# EAGLE schematic Redesign-8Ch-Mux-Breakout-PMODIA (EAGLE 9.6.2)
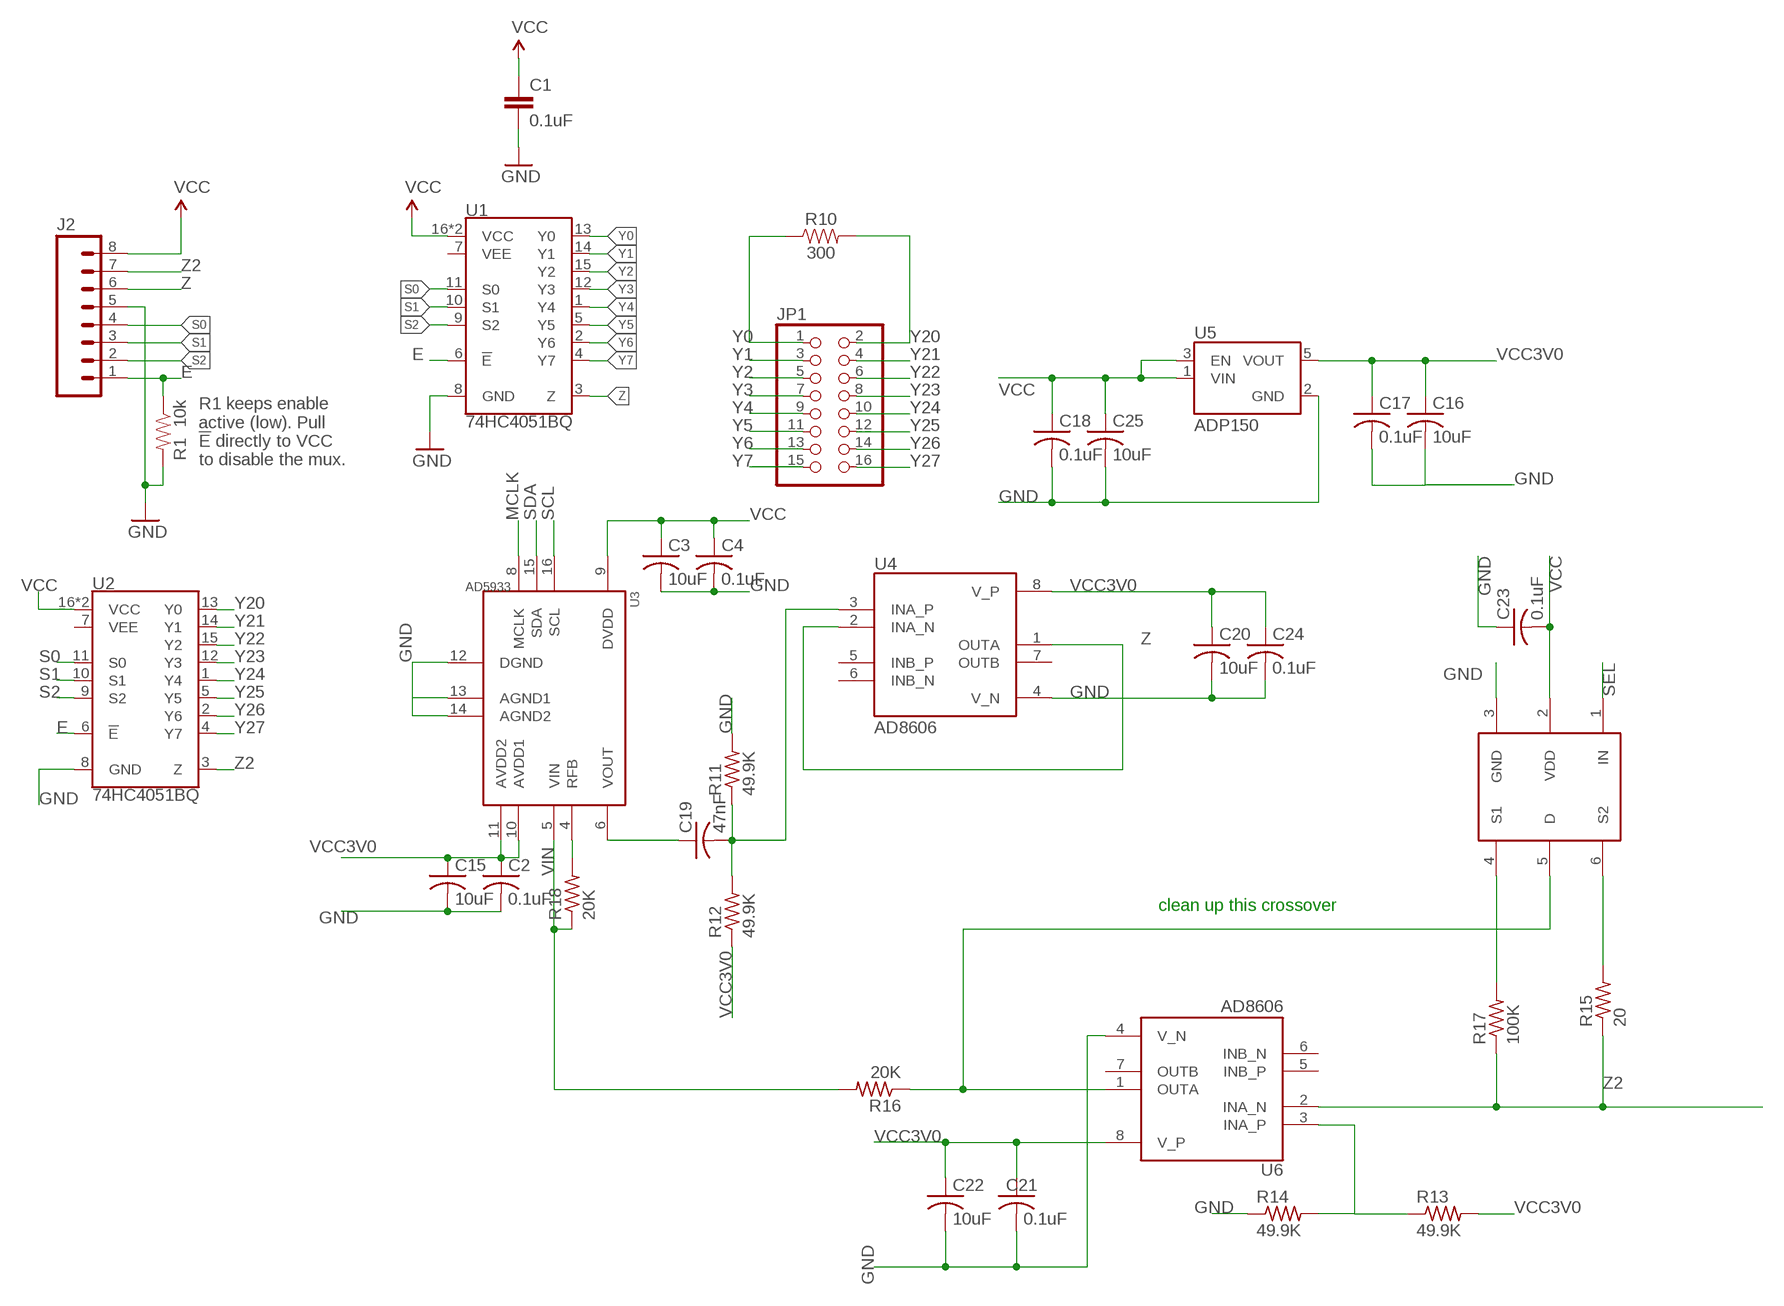
[diagram p0: schematic, sheet 1]

## Parts
C1  0.1uF  0.1UF-0603-25V-(+80/-20%)  [0603]
C2  0.1uF  C-USC0805K  [C0805K]
C3  10uF  C-USC0805K  [C0805K]
C4  0.1uF  C-USC0805K  [C0805K]
C15  10uF  C-USC0805K  [C0805K]
C16  10uF  C-USC0805K  [C0805K]
C17  0.1uF  C-USC0805K  [C0805K]
C18  0.1uF  C-USC0805K  [C0805K]
C19  47nF  C-USC0805K  [C0805K]
C20  10uF  C-USC0805K  [C0805K]
C21  0.1uF  C-USC0805K  [C0805K]
C22  10uF  C-USC0805K  [C0805K]
C23  0.1uF  C-USC0805K  [C0805K]
C24  0.1uF  C-USC0805K  [C0805K]
C25  10uF  C-USC0805K  [C0805K]
J2  M08  [1X08_ROUND]
JP1  PINHD-2X8  [2X08]
R1  10k  10KOHM-0603-1/10W-1%  [0603]
R10  300  0.3OHM-0805-1/8W-1%  [0805]
R11  49.9K  R-US_R0603  [R0603]
R12  49.9K  R-US_R0603  [R0603]
R13  49.9K  R-US_R0603  [R0603]
R14  49.9K  R-US_R0603  [R0603]
R15  20  R-US_R0603  [R0603]
R16  20K  R-US_R0603  [R0603]
R17  100K  R-US_R0603  [R0603]
R18  20K  R-US_R0603  [R0603]
U1  74HC4051BQ  [DHVQFN-16-2.5X3.5MM]
U2  74HC4051BQ  [DHVQFN-16-2.5X3.5MM]
U3  AD5933  [SSOP16]
U4  AD8606  [SOIC-8]
U5  ADP150  [SOT95P280X100-5N]
U6  AD8606  [SOIC-8]
U$1  ADG849THROUHG_HOLE  [SOT65P210X110-6N]

## Nets
E: J2.1 R1.1 U1.6(!E!) U2.6(!E!)
GND: C1.2 C2.2 C3.2 C4.2 C15.2 C16.2 C17.2 C18.2 C20.2 C21.2 C22.2 C23.1 C24.2 C25.2 J2.5 R1.2 R11.2 R14.1 U1.8(GND) U2.8(GND) U3.12(DGND) U3.14(AGND2) U4.4(V_N) U5.2(GND) U6.4(V_N) U$1.3(GND)
MCLK: U3.8(MCLK)
N$1: C19.1 U3.6(VOUT)
N$3: C19.2 R11.1 R12.2 U4.3(INA_P)
N$4: R13.1 R14.2 U6.3(INA_P)
N$5: R18.2 U3.4(RFB)
N$6: R15.2 U$1.6(S2)
N$8: U3.13(AGND1)
N$9: R17.2 U$1.4(S1)
N$11: R16.1 U6.1(OUTA) U$1.5(D)
S0: J2.4 U1.11(S0) U2.11(S0)
S1: J2.3 U1.10(S1) U2.10(S1)
S2: J2.2 U1.9(S2) U2.9(S2)
SCL: U3.16(SCL)
SDA: U3.15(SDA)
SEL: U$1.1(IN)
VCC: C1.1 C3.1 C4.1 C18.1 C23.2 C25.1 J2.8 U1.16(VCC) U1.EP(VCC) U2.16(VCC) U2.EP(VCC) U3.9(DVDD) U5.1(VIN) U5.3(EN) U$1.2(VDD)
VCC3V0: C2.1 C15.1 C16.1 C17.1 C20.1 C21.1 C22.1 C24.1 R12.1 R13.2 U3.10(AVDD1) U3.11(AVDD2) U4.8(V_P) U5.5(VOUT) U6.8(V_P)
VIN: R16.2 R18.1 U3.5(VIN)
Y0: JP1.1 R10.1 U1.13(Y0)
Y1: JP1.3 U1.14(Y1)
Y2: JP1.5 U1.15(Y2)
Y3: JP1.7 U1.12(Y3)
Y4: JP1.9 U1.1(Y4)
Y5: JP1.11 U1.5(Y5)
Y6: JP1.13 U1.2(Y6)
Y7: JP1.15 U1.4(Y7)
Y20: JP1.2 R10.2 U2.13(Y0)
Y21: JP1.4 U2.14(Y1)
Y22: JP1.6 U2.15(Y2)
Y23: JP1.8 U2.12(Y3)
Y24: JP1.10 U2.1(Y4)
Y25: JP1.12 U2.5(Y5)
Y26: JP1.14 U2.2(Y6)
Y27: JP1.16 U2.4(Y7)
Z: J2.6 U1.3(Z) U4.1(OUTA) U4.2(INA_N)
Z2: J2.7 R15.1 R17.1 U2.3(Z) U6.2(INA_N)
Unconnected: U1.7(VEE) U2.7(VEE) U4.5(INB_P) U4.6(INB_N) U4.7(OUTB) U6.5(INB_P) U6.6(INB_N) U6.7(OUTB)

## Notes on the sheet
- R1 keeps enable 
  active (low). Pull 
  !E! directly to VCC 
  to disable the mux.
- clean up this crossover

## Library data of the parts
C1 = SparkFun-Capacitors:0.1UF: 0.1µF ceramic capacitors A capacitor is a passive two-terminal electrical component used to store electrical energy temporarily in an electric field.; PROD_ID: CAP-00810
C2-C4 C15-C25 = rcl:C-US: CAPACITOR, American symbol; SPICEPREFIX: C
J2 = SparkFun-Connectors:M08: Header 8 Standard 8-pin 0.1" header. Use with straight break away headers (SKU : PRT-00116), right angle break away headers (PRT-00553), swiss pins (PRT-00743), machine pins (PRT-00117), and female headers (PRT-00115).; PROD_ID: CONN-08437
JP1 = pinhead:PINHD-2X8: PIN HEADER
R1 = SparkFun-Resistors:10KOHM: 10kΩ resistor A resistor is a passive two-terminal electrical component that implements electrical resistance as a circuit element. Resistors act to reduce current flow, and, at the same time, act to lower voltage levels within circuits. - Wikipedia; PROD_ID: RES-00824
R10 = SparkFun-Resistors:0.3OHM: 0.3Ω resistor A resistor is a passive two-terminal electrical component that implements electrical resistance as a circuit element. Resistors act to reduce current flow, and, at the same time, act to lower voltage levels within circuits. - Wikipedia; PROD_ID: RES-11622; VALUE: 0.3
R11-R18 = rcl:R-US_: RESISTOR, American symbol; SPICEPREFIX: R
U1 U2 = 8mux:74HC4051: NXP 74HC4051 8-Channel Analog Multiplexer/Demultiplexer The 74HC4051; 74HCT4051 is a single-pole octal-throw analog switch (SP8T) suitable for use in analog or digital 8:1 multiplexer/demultiplexer applications. The switch features three digital select inputs (S0, S1 and S2), eight independent inputs/outputs (Yn), a common input/output (Z) and a digital enable input (E). When E is HIGH, the switches are turned off. Inputs include clamp diodes. This enables the use of current limiting resistors to interface inputs to voltages in excess of VCC. Datasheet <http://www.nxp.com/documents/data_sheet/74HC_HCT4051.pdf>; PROD_ID: IC-13334
U3 = PMODIA:AD5933: 1 MSPS, 12-Bit Impedance Converter, Network Analyzer Applications: Electrochemical analysis Bioelectrical impedance analysis Impedance spectroscopy Complex impedance measurement Corrosion monitoring and protection equipment Biomedical and automotive sensors Proximity sensing Nondestructive testing Material property analysis Fuel/battery cell condition monitoring source <http://www.analog.com/static/imported-files/data_sheets/AD5933.pdf>
U4 U6 = Updated PMODIA:AD8606: Operational amplifier; 10MHz; 2.7÷5VDC; Channels: 2; SO8 Check availability <https://pricing.snapeda.com/parts/AD8606ARZ/Analog%20Devices/view-part?ref=eda>; AVAILABILITY: In Stock; CHECK_PRICES: https://www.snapeda.com/parts/AD8606ARZ/Analog+Devices/view-part/?ref=eda; DESCRIPTION: Precision, Low Noise, RRIO, CMOS Op Amp (Dual); MF: Analog Devices; MP: AD8606ARZ; PACKAGE: SOIC-8 Analog Devices; PRICE: None; PURCHASE-URL: https://www.snapeda.com/api/url_track_click_mouser/?unipart_id=43414&manufacturer=Analog Devices&part_name=AD8606ARZ&search_term=ad8606; SNAPEDA_LINK: https://www.snapeda.com/parts/AD8606ARZ/Analog+Devices/view-part/?ref=snap
U5 = Updated PMODIA:ADP150: IC REG LINEAR 2V 150MA 5TSOT Check availability <https://pricing.snapeda.com/parts/ADP150AUJZ-2.0-R7/Analog%20Devices/view-part?ref=eda>; AVAILABILITY: In Stock; CHECK_PRICES: https://www.snapeda.com/parts/ADP150AUJZ-2.0-R7/Analog+Devices/view-part/?ref=eda; DESCRIPTION: Ultralow Noise, 150 mA CMOS Linear Regulator; MF: Analog Devices; MP: ADP150AUJZ-2.0-R7; PACKAGE: TSOT-5 Analog Devices; PRICE: None; PURCHASE-URL: https://www.snapeda.com/api/url_track_click_mouser/?unipart_id=1225884&manufacturer=Analog Devices&part_name=ADP150AUJZ-2.0-R7&search_term=adp150; SNAPEDA_LINK: https://www.snapeda.com/parts/ADP150AUJZ-2.0-R7/Analog+Devices/view-part/?ref=snap
U$1 = Updated_PMODIA_V2:ADG849